# Altium project NAE-CW308T-CC2538.PrjPcb
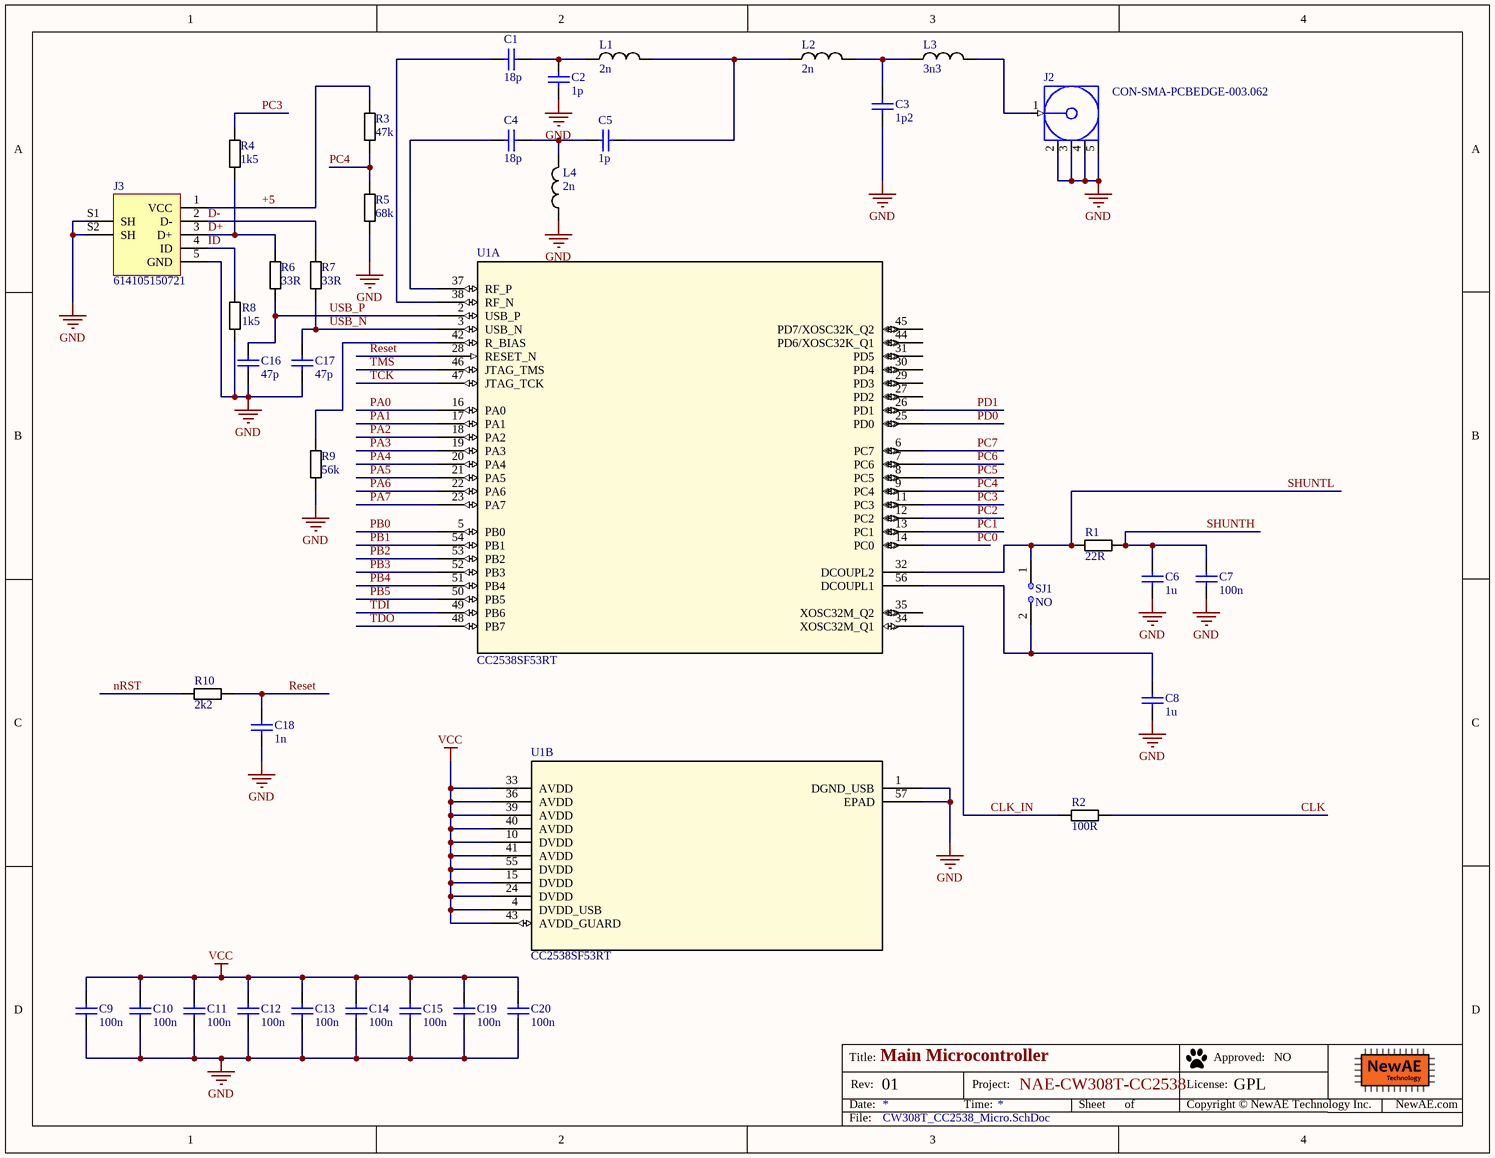
[diagram p0: CW308T_CC2538_Micro.SchDoc]
PrjLicense: GPL; PrjName: NAE-CW308T-CC2538; PrjRev: 01
2 sheets, 40 parts. Net scope: global (net labels, ports and power ports of the same name join across sheets).
Board files: CW308T_CC2538_PANEL.PcbDoc, NPCB-CW308T-CC2538.PcbDoc
Sheets:
  CW308T_CC2538_Micro.SchDoc
  CW308T_CC2538_UFO.SchDoc

## Sheet CW308T_CC2538_Micro.SchDoc: Main Microcontroller
size Letter; Organization: NewAE Technology Inc.; Address1: 1083 Queen St., Suite 196; Address2: Halifax; Address3: NS; Address4: Canada B3H 0B2; SheetApproved: NO

### Parts
C1  18p  [CAPC0402_M]
C2  1p  [CAPC0402_M]
C3  1p2  [CAPC0402_M]
C4  18p  [CAPC0402_M]
C5  1p  [CAPC0402_M]
C6  1u  [CAPC0603_M]
C7  100n  [CAPC0603_M]
C8  1u  [CAPC0603_M]
C9  100n  [CAPC0603_M]
C10  100n  [CAPC0603_M]
C11  100n  [CAPC0603_M]
C12  100n  [CAPC0603_M]
C13  100n  [CAPC0603_M]
C14  100n  [CAPC0603_M]
C15  100n  [CAPC0603_M]
C16  47p  [CAPC0603_M]
C17  47p  [CAPC0603_M]
C18  1n  [CAPC0603_M]
C19  100n  [CAPC0603_M]
C20  100n  [CAPC0603_M]
J2  CON-SMA-PCBEDGE-003.062  [CON-SMAM-PCB-EDGE062]
J3  614105150721  [614105150721]
L1  2n  [RESC1005X40N]
L2  2n  [RESC1005X40N]
L3  3n3  [RESC1005X40N]
L4  2n  [RESC1005X40N]
R1  22R  [RESC1608X55N]
R2  100R  [RESC1608X55N]
R3  47k  [RESC1608X55N]
R4  1k5  [RESC1608X55N]
R5  68k  [RESC1608X55N]
R6  33R  [RESC1608X55N]
R7  33R  [RESC1608X55N]
R8  1k5  [RESC1608X55N]
R9  56k  [RESC1608X55N]
R10  2k2  [RESC1608X55N]
SJ1  NO  [SJ_2S_NO]  (no BOM)
U1  CC2538SF53RT  [QFN50P800X800X100_HS-57M]  (parts A,B of 2)

### Nets
GND: C2.1 C3.2 C6.2 C7.2 C8.2 C9.2 C10.2 C11.2 C12.2 C13.2 C14.2 C15.2 C16.2 C17.2 C18.2 C19.2 C20.2 J2.2(GND) J2.3(GND) J2.4(GND) J2.5(GND) J3.5(GND) J3.S1(SH) J3.S2(SH) L4.1 R5.2 R8.2 R9.1 U1.1(DGND_USB) U1.57(EPAD)
VCC: C9.1 C10.1 C11.1 C12.1 C13.1 C14.1 C15.1 C19.1 C20.1 U1.4(DVDD_USB) U1.10(DVDD) U1.15(DVDD) U1.24(DVDD) U1.33(AVDD) U1.36(AVDD) U1.39(AVDD) U1.40(AVDD) U1.41(AVDD) U1.43(AVDD_GUARD) U1.55(DVDD)
+5: J3.1(VCC) R3.1
CLK: R2.2
CLK_IN: R2.1 U1.34(XOSC32M_Q1)
D+: J3.3(D+) R4.1 R6.2
D-: J3.2(D-) R7.1
ID: J3.4(ID) R8.1
nRST: R10.1
PA0: U1.16(PA0)
PA1: U1.17(PA1)
PA2: U1.18(PA2)
PA3: U1.19(PA3)
PA4: U1.20(PA4)
PA5: U1.21(PA5)
PA6: U1.22(PA6)
PA7: U1.23(PA7)
PB0: U1.5(PB0)
PB1: U1.54(PB1)
PB2: U1.53(PB2)
PB3: U1.52(PB3)
PB4: U1.51(PB4)
PB5: U1.50(PB5)
PC0: U1.14(PC0)
PC1: U1.13(PC1)
PC2: U1.12(PC2)
PC3: R4.2 U1.11(PC3)
PC4: R3.2 R5.1 U1.9(PC4)
PC5: U1.8(PC5)
PC6: U1.7(PC6)
PC7: U1.6(PC7)
PD0: U1.25(PD0)
PD1: U1.26(PD1)
Reset: C18.1 R10.2 U1.28(RESET_N)
SHUNTH: C6.1 C7.1 R1.2
SHUNTL: R1.1 SJ1.1 U1.32(DCOUPL2)
TCK: U1.47(JTAG_TCK)
TDI: U1.49(PB6)
TDO: U1.48(PB7)
TMS: U1.46(JTAG_TMS)
USB_N: C17.1 R7.2 U1.3(USB_N)
USB_P: C16.1 R6.1 U1.2(USB_P)
NetC1_1: C1.1 U1.38(RF_N)
NetC1_2: C1.2 C2.2 L1.1
NetC3_1: C3.1 L2.2 L3.1
NetC4_1: C4.1 U1.37(RF_P)
NetC4_2: C4.2 C5.1 L4.2
NetC5_2: C5.2 L1.2 L2.1
NetC8_1: C8.1 SJ1.2 U1.56(DCOUPL1)
NetJ2_1: J2.1(Signal) L3.2
NetR9_2: R9.2 U1.42(R_BIAS)

Not connected (* = marked no-connect by the designer): U1 27(PD2) 29(PD3) 30(PD4) 31(PD5) 35(XOSC32M_Q2) 44(PD6/XOSC32K_Q1) 45(PD7/XOSC32K_Q2)

### Notes on the sheet
- Title:
- Date:
- Rev:
- Time:
- Project:
- Sheet
- of
- License:
- Copyright © NewAE Technology Inc.
- Approved:
- NewAE.com
- File:

### Library data of the parts
C1 C4 = CCHIP-18p-0402: 18p, 0402; Manufacture Part Number 1: GRM1555C1H180JA01D; Component Group: Capacitor; Case-EIA: 0402; Part Number: CCHIP-18p-0402; Footprint: 0402; Pin Count: 2; Value: 18p; Mounting Technology: SMT; Component Kind: Standard; Component Type: Standard
C2 C5 = CCHIP-1p-0402: 1p, 0402; Manufacture Part Number 1: GRM1555C1H1R0BA01D; Component Group: Capacitor; Case-EIA: 0402; Part Number: CCHIP-1p-0402; Footprint: 0402; Pin Count: 2; Value: 1p; Mounting Technology: SMT; RoHS: Yes; Component Kind: Standard; Component Type: Standard
C3 = CCHIP-1p2-0402: 1p2, 0402; Manufacture Part Number 1: GRM1555C1H1R2CA01D; Component Group: Capacitor; Case-EIA: 0402; Part Number: CCHIP-1p2-0402; Footprint: 0402; Pin Count: 2; Value: 1p2; Mounting Technology: SMT; RoHS: Yes; Component Kind: Standard; Component Type: Standard
C6 C8 = CCHIP-1u-0603: 1u, 0603; Manufacture Part Number 1: CL10A105KB8NNNC; Component Group: Capacitor; Case-EIA: 0603; Case-Metric: 1608; Rated Voltage: 50V; Part Number: CCHIP-1u-0603; Footprint: 0603; Pin Count: 2; Value: 1u; Mounting Technology: SMT; Component Kind: Standard; Component Type: Standard; Supplier 1: Digi-Key; Supplier Part Number 1: 1276-1860-1-ND
C7 C9-C15 C19 C20 = CCHIP-100n-0603: 100n, 0603; Manufacture 1: Kemet; Manufacture Part Number 1: C0603C104K5RACTU; Component Group: Capacitor; Case-EIA: 0603; Case-Metric: 1608; Rated Voltage: 50V; Part Number: CCHIP-100n-0603; Footprint: 0603; Pin Count: 2; Value: 100n; Mounting Technology: SMT; Component Kind: Standard; Component Type: Standard; Supplier 1: Digi-Key; Supplier Part Number 1: 399-5089-2-ND
C16 C17 = CCHIP-47p-0603: 47p, 0603; Component Group: Capacitor; Case-EIA: 0603; Case-Metric: 1608; Part Number: CCHIP-47p-0603; Footprint: 0603; Pin Count: 2; Value: 47p; Mounting Technology: SMT; Component Kind: Standard; Component Type: Standard
C18 = CCHIP-1n-0603: 1n, 0603; Manufacture 1: Kemet; Component Group: Capacitor; Case-EIA: 0603; Case-Metric: 1608; Rated Voltage: 50V; Part Number: CCHIP-1n-0603; Footprint: 0603; Pin Count: 2; Supplier 1: Digi-Key; Value: 1n; Mounting Technology: SMT; Component Kind: Standard; Component Type: Standard
J2 = CON-SMA-PCBEDGE-003.062: SMA Female Edge Mount Connector for 0.062" Thick Board; PCB_Layout: Pads complies with manufacturer's recommendation.; DatasheetVersion: rev1.0, Aug-2006; PackageVersion: rev1.0, Aug-2006; PackageReference: CON-SMA-EDGE062; PackageDescription: SMA Female Edge Mount Connector for 0.062" Thick Board, 7.9 mm Body Dia.; ComponentLink1Description: Manufacturer URL; ComponentLink1URL: http://www.linxtechnologies.com/; ComponentLink2Description: Datasheet; ComponentLink2URL: http://www.connectorcity.com/diagrams/SMA/CONSMA003.062.pdf; Part Number: CON-SMA-PCBEDGE-003.062; Component Group: Connector; Pin Count: 5; Component Kind: Standard; Component Type: Standard
J3 = 614105150721: USB, 5-pin, Upright; Manufacture 1: Wurth Electronics; Component Group: Connector; PP Material Stack: 0; Part Number: 614105150721; Manufacture Part Number 1: 614105150721; Pin Count: 7; Supplier 1: Digi-Key; Supplier Part Number 1: 732-5958-1-ND; Mounting Technology: Through-hole; RoHS: Yes; Component Kind: Standard; Component Type: Standard; PP Rotation: 0
L1 L2 L4 = LCHIP-2n-0402: 2nF, 0402; Manufacture Part Number 1: LQG15HS2N0S02D; Component Group: Inductor; Case-EIA: 0402; Part Number: LCHIP-2n-0402; Footprint: 0402; Pin Count: 2; Value: 2n; Mounting Technology: SMT; RoHS: Yes; Component Kind: Standard; Component Type: Standard
L3 = LCHIP-3n3-0402: 3.3nF, 0402; Manufacture Part Number 1: LQG15HS3N3S02D; Component Group: Inductor; Case-EIA: 0402; Part Number: LCHIP-3n3-0402; Footprint: 0402; Pin Count: 2; Value: 3n3; Mounting Technology: SMT; RoHS: Yes; Component Kind: Standard; Component Type: Standard
R1 = RCHIP-22R-0603: 22R res, 0603, 1%, 1/10W; Manufacture 1: Yageo; Manufacture Part Number 1: RC0603FR-0722RL; Component Group: Resistor; Case-EIA: 0603; Case-Metric: 1608; Rated Power: 0.1W; Rated Voltage: 75VDC; Part Number: RCHIP-22R-0603; Footprint: 0603; Pin Count: 2; Supplier 1: Digi-Key; Supplier Part Number 1: 311-22.0HRCT-ND; Value: 22R; Tolerance: 1%; Mounting Technology: SMT; Temperature Range: -55C to 155C; Component Kind: Standard; Component Type: Standard
R2 = RCHIP-100R-0603: 100R res, 0603, 1%, 1/10W; Manufacture 1: Yageo; Manufacture Part Number 1: RC0603FR-07100RL; Component Group: Resistor; Case-EIA: 0603; Case-Metric: 1608; Rated Power: 0.1W; Rated Voltage: 75VDC; Part Number: RCHIP-100R-0603; Footprint: 0603; Pin Count: 2; Supplier 1: Digi-Key; Supplier Part Number 1: 311-100HRCT-ND; Value: 100R; Tolerance: 1%; Mounting Technology: SMT; Temperature Range: -55C to 155C; Component Kind: Standard; Component Type: Standard
R3 = RCHIP-47K-0603: 47k res, 0603, 1%, 1/10W; Manufacture 1: Yageo; Manufacture Part Number 1: RC0603FR-0747KL; Component Group: Resistor; Case-EIA: 0603; Case-Metric: 1608; Rated Power: 0.1W; Rated Voltage: 75VDC; Part Number: RCHIP-47K-0603; Footprint: 0603; Pin Count: 2; Supplier 1: Digi-Key; Supplier Part Number 1: 311-47.0KHRCT-ND; Value: 47k; Tolerance: 1%; Mounting Technology: SMT; Temperature Range: -55C to 155C; Component Kind: Standard; Component Type: Standard
R4 R8 = RCHIP-1K5-0603: 1k5 res, 0603, 1%, 1/10W; Manufacture 1: Yageo; Manufacture Part Number 1: RC0603FR-071K5L; Component Group: Resistor; Case-EIA: 0603; Case-Metric: 1608; Rated Power: 0.1W; Rated Voltage: 75VDC; Part Number: RCHIP-1K5-0603; Footprint: 0603; Pin Count: 2; Supplier 1: Digi-Key; Supplier Part Number 1: 311-1.50KHRCT-ND; Value: 1k5; Tolerance: 1%; Mounting Technology: SMT; Temperature Range: -55C to 155C; Component Kind: Standard; Component Type: Standard
R5 = RCHIP-68K-0603: 68k res, 0603, 1%, 1/10W; Manufacture 1: Yageo; Manufacture Part Number 1: RC0603FR-0768KL; Component Group: Resistor; Case-EIA: 0603; Case-Metric: 1608; Rated Power: 0.1W; Rated Voltage: 75VDC; Part Number: RCHIP-68K-0603; Footprint: 0603; Pin Count: 2; Supplier 1: Digi-Key; Supplier Part Number 1: 311-68.0KHRCT-ND; Value: 68k; Tolerance: 1%; Mounting Technology: SMT; Temperature Range: -55C to 155C; Component Kind: Standard; Component Type: Standard
R6 R7 = RCHIP-33R-0603: 33R res, 0603, 1%, 1/10W; Manufacture 1: Yageo; Manufacture Part Number 1: RC0603FR-0733RL; Component Group: Resistor; Case-EIA: 0603; Case-Metric: 1608; Rated Power: 0.1W; Rated Voltage: 75VDC; Part Number: RCHIP-33R-0603; Footprint: 0603; Pin Count: 2; Supplier 1: Digi-Key; Supplier Part Number 1: 311-33.0HRCT-ND; Value: 33R; Tolerance: 1%; Mounting Technology: SMT; Temperature Range: -55C to 155C; Component Kind: Standard; Component Type: Standard
R9 = RCHIP-56K-0603: 56k res, 0603, 1%, 1/10W; Manufacture 1: Yageo; Manufacture Part Number 1: RC0603FR-0756KL; Component Group: Resistor; Case-EIA: 0603; Case-Metric: 1608; Rated Power: 0.1W; Rated Voltage: 75VDC; Part Number: RCHIP-56K-0603; Footprint: 0603; Pin Count: 2; Supplier 1: Digi-Key; Supplier Part Number 1: 311-56KHRCT-ND; Value: 56k; Tolerance: 1%; Mounting Technology: SMT; Temperature Range: -55C to 155C; Component Kind: Standard; Component Type: Standard
R10 = RCHIP-2K2-0603: 2k2 res, 0603, 1%, 1/10W; Manufacture 1: Yageo; Manufacture Part Number 1: RC0603FR-072K2L; Component Group: Resistor; Case-EIA: 0603; Case-Metric: 1608; Rated Power: 0.1W; Rated Voltage: 75VDC; Part Number: RCHIP-2K2-0603; Footprint: 0603; Pin Count: 2; Supplier 1: Digi-Key; Supplier Part Number 1: 311-2.20KHRCT-ND; Value: 2k2; Tolerance: 1%; Mounting Technology: SMT; Temperature Range: -55C to 155C; Component Kind: Standard; Component Type: Standard
SJ1 = SJ_2S_NO: Solder Jumper, NO; Component Group: PCB Feature; Part Number: SJ_2S_NO; Pin Count: 2; Mounting Technology: COPPER; Component Type: Standard (No BOM)
U1 = CC2538SF53RTQT: IC RF TXRX+MCU 802.15.4, ARM, ECC/AES/RSA; Manufacturer_Part_Number: cc2538_rtq_56; Vendor: Texas Instruments; C: Copyright (C) 2015 Accelerated Designs. All rights reserved; Component Group: Digital IC; Copyright: Copyright (C) 2015 Accelerated Designs. All rights reserved; Value: Value; Type: Type; RefDes: RefDes; Part Number: CC2538SF53RTQT; Footprint: QFN57; Manufacture 1: Texas Instruments; Manufacture Part Number 1: CC2538SF53RTQT; Pin Count: 57; Supplier 1: Digi-Key; Supplier Part Number 1: 296-35797-1-ND; Mounting Technology: SMT; RoHS: Yes; Temperature Range: -40°C ~ 125°C; Component Kind: Standard; Component Type: Standard

## Sheet CW308T_CC2538_UFO.SchDoc: UFO Connections
size Letter; Organization: NewAE Technology Inc.; Address1: 1083 Queen St., Suite 196; Address2: Halifax; Address3: NS; Address4: Canada B3H 0B2; SheetApproved: NO
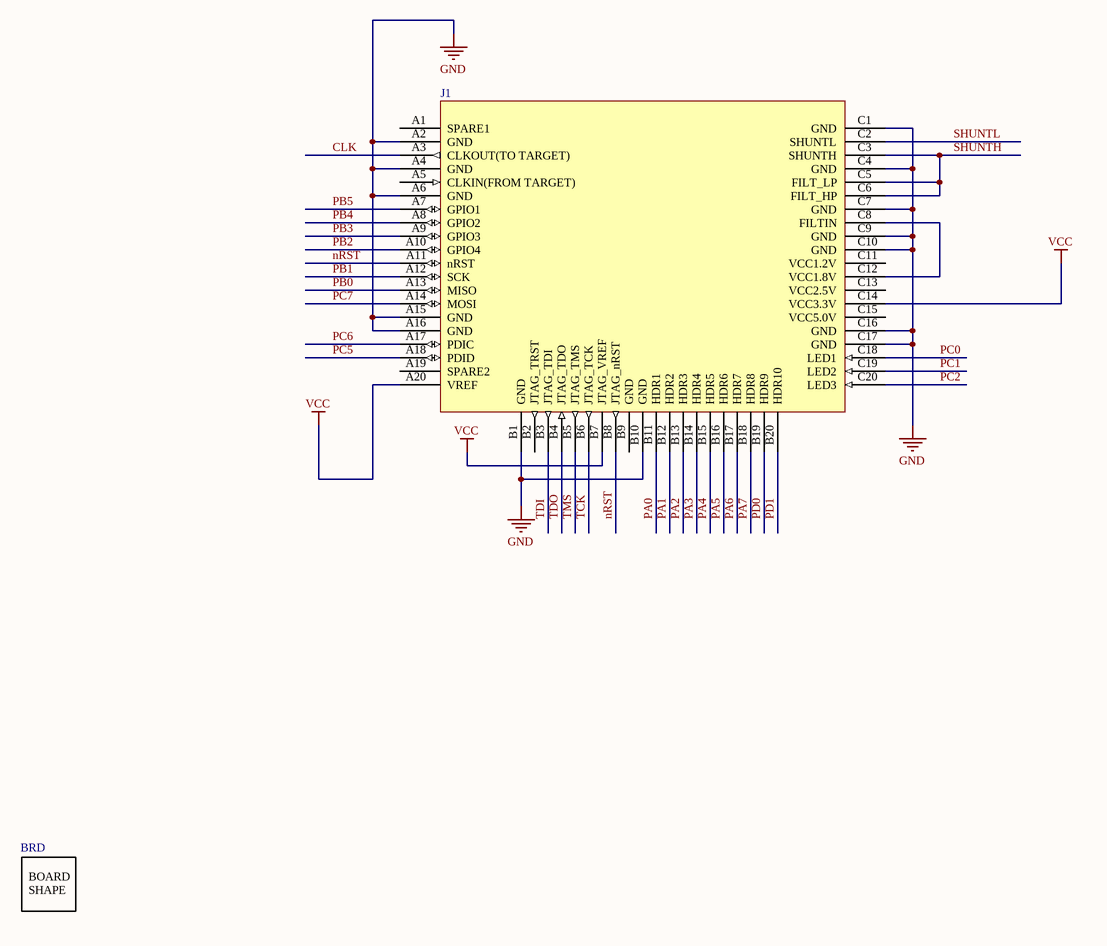
[diagram p1: CW308T_CC2538_UFO.SchDoc]

### Parts
BRD  (no value)  [CW308T_TBOARD_DEFSIZE]
J1  (no value)  [CW308_TBOARD_CONN]

### Nets
GND: J1.A2(GND) J1.A4(GND) J1.A6(GND) J1.A15(GND) J1.A16(GND) J1.B1(GND) J1.B10(GND) J1.C1(GND) J1.C4(GND) J1.C7(GND) J1.C9(GND) J1.C10(GND) J1.C16(GND) J1.C17(GND)
VCC: J1.A20(VREF) J1.B7(JTAG_VREF) J1.C14(VCC3.3V)
CLK: J1.A3(CLKOUT(TO_TARGET))
nRST: J1.A11(nRST) J1.B8(JTAG_nRST)
PA0: J1.B11(HDR1)
PA1: J1.B12(HDR2)
PA2: J1.B13(HDR3)
PA3: J1.B14(HDR4)
PA4: J1.B15(HDR5)
PA5: J1.B16(HDR6)
PA6: J1.B17(HDR7)
PA7: J1.B18(HDR8)
PB0: J1.A13(MISO)
PB1: J1.A12(SCK)
PB2: J1.A10(GPIO4)
PB3: J1.A9(GPIO3)
PB4: J1.A8(GPIO2)
PB5: J1.A7(GPIO1)
PC0: J1.C18(LED1)
PC1: J1.C19(LED2)
PC2: J1.C20(LED3)
PC5: J1.A18(PDID)
PC6: J1.A17(PDIC)
PC7: J1.A14(MOSI)
PD0: J1.B19(HDR9)
PD1: J1.B20(HDR10)
SHUNTH: J1.C3(SHUNTH) J1.C5(FILT_LP) J1.C6(FILT_HP)
SHUNTL: J1.C2(SHUNTL)
TCK: J1.B6(JTAG_TCK)
TDI: J1.B3(JTAG_TDI)
TDO: J1.B4(JTAG_TDO)
TMS: J1.B5(JTAG_TMS)
NetJ1_C8: J1.C8(FILTIN) J1.C12(VCC1.8V)

Not connected (* = marked no-connect by the designer): J1 A1(SPARE1) A5(CLKIN(FROM_TARGET)) A19(SPARE2) B2(JTAG_TRST) B9(GND) C11(VCC1.2V) C13(VCC2.5V) C15(VCC5.0V)

### Notes on the sheet
- Title:
- Date:
- Rev:
- Time:
- Project:
- Sheet
- of
- License:
- Copyright © NewAE Technology Inc.
- Approved:
- NewAE.com
- File:
- (in symbol CW308T_BRDSHAPE_DEFAULT) BOARD / SHAPE

### Library data of the parts
BRD = CW308T_BRDSHAPE_DEFAULT: 308T Board Outline (Layer 1); Component Group: Mechanical; Part Number: CW308T_BRDSHAPE_DEFAULT; Component Kind: Mechanical; Component Type: Mechanical
J1 = CW308_TBOARD: CW308 "Standard" Target Board Connector; Component Group: Mechanical; Pitch: 2.54mm; Part Number: CW308_TBOARD; Pin Count: 60; Mounting Technology: Through-hole; Component Kind: Standard; Component Type: Standard

## Nets that join several sheets
GND: CW308T_CC2538_Micro (30 pins), CW308T_CC2538_UFO (14 pins)
VCC: CW308T_CC2538_Micro (20 pins), CW308T_CC2538_UFO (J1.A20 J1.B7 J1.C14)
CLK: CW308T_CC2538_Micro (R2.2), CW308T_CC2538_UFO (J1.A3)
nRST: CW308T_CC2538_Micro (R10.1), CW308T_CC2538_UFO (J1.A11 J1.B8)
PA0: CW308T_CC2538_Micro (U1.16), CW308T_CC2538_UFO (J1.B11)
PA1: CW308T_CC2538_Micro (U1.17), CW308T_CC2538_UFO (J1.B12)
PA2: CW308T_CC2538_Micro (U1.18), CW308T_CC2538_UFO (J1.B13)
PA3: CW308T_CC2538_Micro (U1.19), CW308T_CC2538_UFO (J1.B14)
PA4: CW308T_CC2538_Micro (U1.20), CW308T_CC2538_UFO (J1.B15)
PA5: CW308T_CC2538_Micro (U1.21), CW308T_CC2538_UFO (J1.B16)
PA6: CW308T_CC2538_Micro (U1.22), CW308T_CC2538_UFO (J1.B17)
PA7: CW308T_CC2538_Micro (U1.23), CW308T_CC2538_UFO (J1.B18)
PB0: CW308T_CC2538_Micro (U1.5), CW308T_CC2538_UFO (J1.A13)
PB1: CW308T_CC2538_Micro (U1.54), CW308T_CC2538_UFO (J1.A12)
PB2: CW308T_CC2538_Micro (U1.53), CW308T_CC2538_UFO (J1.A10)
PB3: CW308T_CC2538_Micro (U1.52), CW308T_CC2538_UFO (J1.A9)
PB4: CW308T_CC2538_Micro (U1.51), CW308T_CC2538_UFO (J1.A8)
PB5: CW308T_CC2538_Micro (U1.50), CW308T_CC2538_UFO (J1.A7)
PC0: CW308T_CC2538_Micro (U1.14), CW308T_CC2538_UFO (J1.C18)
PC1: CW308T_CC2538_Micro (U1.13), CW308T_CC2538_UFO (J1.C19)
PC2: CW308T_CC2538_Micro (U1.12), CW308T_CC2538_UFO (J1.C20)
PC5: CW308T_CC2538_Micro (U1.8), CW308T_CC2538_UFO (J1.A18)
PC6: CW308T_CC2538_Micro (U1.7), CW308T_CC2538_UFO (J1.A17)
PC7: CW308T_CC2538_Micro (U1.6), CW308T_CC2538_UFO (J1.A14)
PD0: CW308T_CC2538_Micro (U1.25), CW308T_CC2538_UFO (J1.B19)
PD1: CW308T_CC2538_Micro (U1.26), CW308T_CC2538_UFO (J1.B20)
SHUNTH: CW308T_CC2538_Micro (C6.1 C7.1 R1.2), CW308T_CC2538_UFO (J1.C3 J1.C5 J1.C6)
SHUNTL: CW308T_CC2538_Micro (R1.1 SJ1.1 U1.32), CW308T_CC2538_UFO (J1.C2)
TCK: CW308T_CC2538_Micro (U1.47), CW308T_CC2538_UFO (J1.B6)
TDI: CW308T_CC2538_Micro (U1.49), CW308T_CC2538_UFO (J1.B3)
TDO: CW308T_CC2538_Micro (U1.48), CW308T_CC2538_UFO (J1.B4)
TMS: CW308T_CC2538_Micro (U1.46), CW308T_CC2538_UFO (J1.B5)

## Assembly variants
Production of NAE-CW308T-CC2538: not fitted C1 C2 C3 C4 C5 C16 C17 J2 J3 L1 L2 L3 L4 R3 R4 R5 R6 R7 R8